# Altium schematic sheet Status Light Control.SchDoc
size A; SheetNumber: 4; SheetTotal: 10
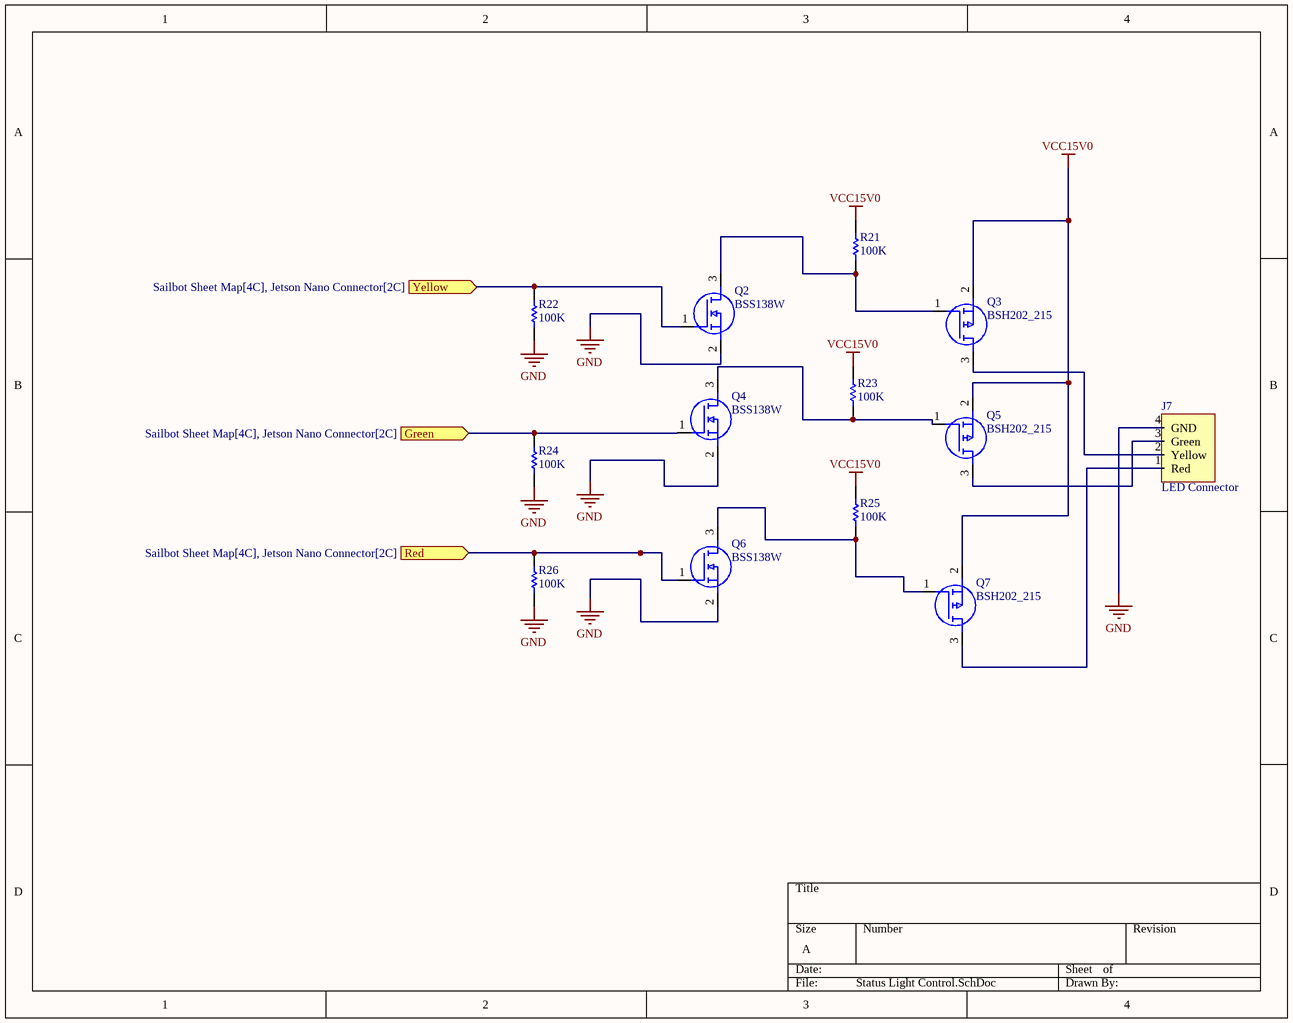
[diagram p0: Status Light Control.SchDoc]

## Parts
J7  LED Connector  [4 Pin 0.1in Header]
Q2  BSS138W  [SOT65P210X110-3N]
Q3  BSH202_215  [SOT95P230X110-3N]
Q4  BSS138W  [SOT65P210X110-3N]
Q5  BSH202_215  [SOT95P230X110-3N]
Q6  BSS138W  [SOT65P210X110-3N]
Q7  BSH202_215  [SOT95P230X110-3N]
R21  value 100K  [6-0805_M]  (hidden comment: Resistor)
R22  value 100K  [6-0805_M]  (hidden comment: Resistor)
R23  value 100K  [6-0805_M]  (hidden comment: Resistor)
R24  value 100K  [6-0805_M]  (hidden comment: Resistor)
R25  value 100K  [6-0805_M]  (hidden comment: Resistor)
R26  value 100K  [6-0805_M]  (hidden comment: Resistor)

## Ports
Green (in, see Sailbot Sheet Map[4C], Jetson Nano Connector[2C]), Red (in, see Sailbot Sheet Map[4C], Jetson Nano Connector[2C]), Yellow (in, see Sailbot Sheet Map[4C], Jetson Nano Connector[2C])

## Nets
GND: J7.4(GND) Q2.2(S) Q4.2(S) Q6.2(S) R22.1 R24.1 R26.1
VCC15V0: Q3.2(S) Q5.2(S) Q7.2(S) R21.2 R23.2 R25.2
Green: Q4.1(G) R24.2 ; port Green
Red: Q6.1(G) R26.2 ; port Red
Yellow: Q2.1(G) R22.2 ; port Yellow
NetJ7_1: J7.1(Red) Q7.3(D)
NetJ7_2: J7.2(Yellow) Q3.3(D)
NetJ7_3: J7.3(Green) Q5.3(D)
NetQ2_3: Q2.3(D) Q3.1(G) R21.1
NetQ4_3: Q4.3(D) Q5.1(G) R23.1
NetQ6_3: Q6.3(D) Q7.1(G) R25.1

## Library data of the parts
Q2 Q4 Q6 = BSS138W: BSS138W N-Channel MOSFET, 210 mA, 50 V, 3-Pin SOT-323 ON Semiconductor; Manufacturer_Name: onsemi; Geometry.Height: 1.1mm; Mouser Part Number: 512-BSS138W; Mouser Price/Stock: https://www.mouser.co.uk/ProductDetail/onsemi-Fairchild/BSS138W?qs=iQhsftLtcNQX02h325QGXg%3D%3D; Manufacturer_Part_Number: BSS138W; Datasheet Link: https://www.onsemi.com/pub/Collateral/BSS138W-D.pdf
Q3 Q5 Q7 = BSH202_215: NEXPERIA - BSH202,215 - Power MOSFET, P Channel, 30 V, 520 mA, 0.63 ohm, SOT-23, Surface Mount; Geometry.Height: 1.1mm; Mouser Part Number: 771-BSH202215; Mouser Price/Stock: https://www.mouser.co.uk/ProductDetail/Nexperia/BSH202215?qs=me8TqzrmIYVIfEr%252BmEwLmg%3D%3D; Manufacturer_Name: Nexperia; Manufacturer_Part_Number: BSH202,215; Datasheet Link: https://assets.nexperia.com/documents/data-sheet/BSH202.pdf
R21-R26 = Resistor: TC1: 0; SimulationGenericComponent: True; TC2: 0